# Altium project 升压模块12V转15V.PrjPCB
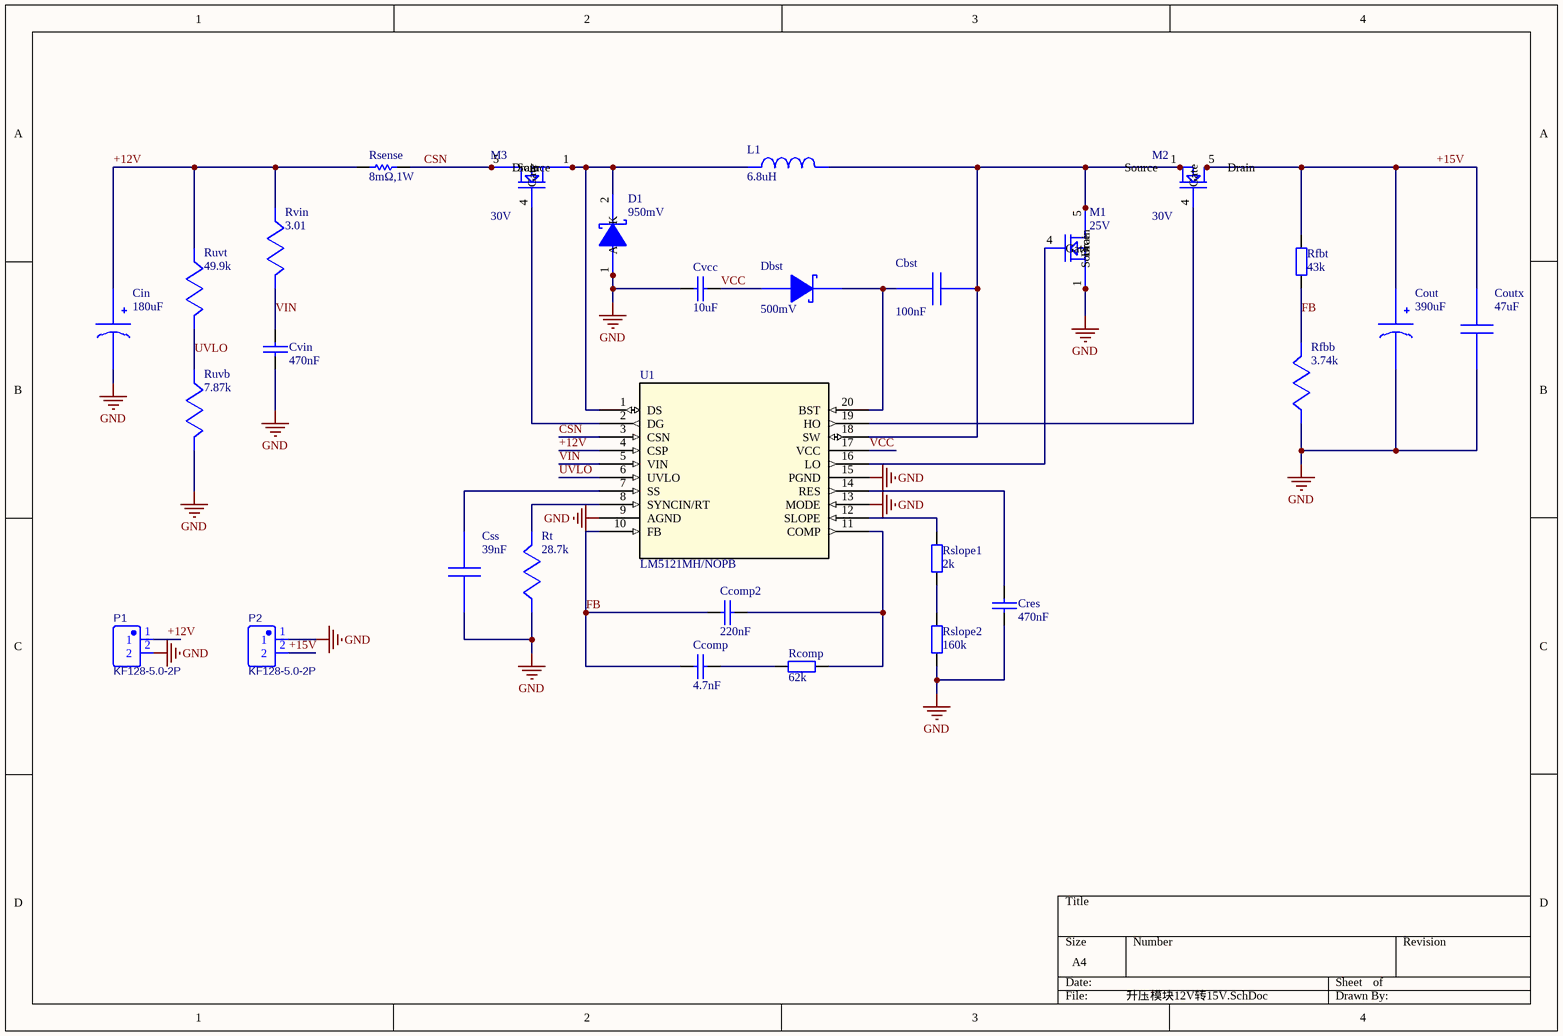
[diagram p0: 升压模块12V转15V.SchDoc]
1 sheet, 29 parts. Net scope: global (net labels, ports and power ports of the same name join across sheets).
Board file: 升压模块12V转15V.PcbDoc

## Sheet 升压模块12V转15V.SchDoc
size A4

### Parts
Cbst  value 100nF  [0805]  (hidden comment: C0805C104M5RACTU)
Ccomp  4.7nF  [0805C]
Ccomp2  220nF  [0805C]
Cin  value 180uF  [CAPSMT_62_E7]  (hidden comment: 20SVPF180M)
Cout  value 390uF  [CAPSMT_62_E12]  (hidden comment: 20SVPF390M)
Coutx  value 47uF  [1206]  (hidden comment: C3216X5R1E476M160AC)
Cres  470nF  [0805C]
Css  value 39nF  [0402]  (hidden comment: GRM155R71E393KA88D)
Cvcc  10uF  [0805C]
Cvin  470nF  [0805C]
D1  value 950mV  [DPAK]  (hidden comment: SBRD10200TR)
Dbst  value 500mV  [SMB]  (hidden comment: B220-13-F)
L1  value 6.8uH  [SER2915L]  (hidden comment: SER2915L-682KL)
M1  value 25V  [DQG0008A]  (hidden comment: CSD16327Q3)
M2  value 30V  [DQG0008A]  (hidden comment: CSD17575Q3)
M3  value 30V  [TRANS_Fairchild_]  (hidden comment: FDMC7660DC)
P1  KF128-5.0-2P  [CONN-TH_P5.00_KF128-5.0-2P]
P2  KF128-5.0-2P  [CONN-TH_P5.00_KF128-5.0-2P]
Rcomp  62k  [0805R]
Rfbb  value 3.74k  [0402]  (hidden comment: CRCW04023K74FKED)
Rfbt  43k  [0805R]
Rsense  8mΩ,1W  [R2512]
Rslope1  2k  [0805R]
Rslope2  160k  [0805R]
Rt  value 28.7k  [0201]  (hidden comment: RC0201FR-0728K7L)
Ruvb  value 7.87k  [0402]  (hidden comment: CRCW04027K87FKED)
Ruvt  value 49.9k  [0402]  (hidden comment: CRCW040249K9FKED)
Rvin  value 3.01  [0402]  (hidden comment: CRCW04023R01FKED)
U1  LM5121MH/NOPB  [PWP20_TEX]

### Nets
GND: Cin.2(-) Cout.2(-) Coutx.2 Cres.1 Css.2 Cvcc.1 Cvin.1 D1.1(A) D1.3(A) M1.1(Source) M1.2(Source) M1.3(Source) P1.2 P2.1 Rfbb.2 Rslope2.1 Rt.2 Ruvb.1 U1.9(AGND) U1.13(MODE) U1.15(PGND)
+12V: Cin.1(+) P1.1 Rsense.1 Ruvt.2 Rvin.2 U1.4(CSP)
+15V: Cout.1(+) Coutx.1 M2.5(Drain) M2.6(Drain) M2.7(Drain) M2.8(Drain) M2.9(Drain) P2.2 Rfbt.2
CSN: M3.5(Drain) M3.6(Drain) M3.7(Drain) M3.8(Drain) Rsense.2 U1.3(CSN)
FB: Ccomp.2 Ccomp2.2 Rfbb.1 Rfbt.1 U1.10(FB)
UVLO: Ruvb.2 Ruvt.1 U1.6(UVLO)
VCC: Cvcc.2 Dbst.2(A) U1.17(VCC)
VIN: Cvin.2 Rvin.1 U1.5(VIN)
NetCbst_1: Cbst.1 L1.2 M1.5(Drain) M1.6(Drain) M1.7(Drain) M1.8(Drain) M1.9(Drain) M2.1(Source) M2.2(Source) M2.3(Source) U1.18(SW)
NetCbst_2: Cbst.2 Dbst.1(K) U1.20(BST)
NetCcomp2_1: Ccomp2.1 Rcomp.1 U1.11(COMP)
NetCcomp_1: Ccomp.1 Rcomp.2
NetCres_2: Cres.2 U1.14(RES)
NetCss_1: Css.1 U1.7(SS)
NetD1_2: D1.2(K) L1.1 M3.1(Source) M3.2(Source) M3.3(Source) U1.1(DS)
NetM1_4: M1.4(Gate) U1.16(LO)
NetM2_4: M2.4(Gate) U1.19(HO)
NetM3_4: M3.4(Gate) U1.2(DG)
NetRslope1_1: Rslope1.1 Rslope2.2
NetRslope1_2: Rslope1.2 U1.12(SLOPE)
NetRt_1: Rt.1 U1.8(SYNCIN/RT)

### Library data of the parts
Cbst = Cbst: Manufacturer Name: Kemet; PackageReference: C0805C104M5RACTU; Manufacturer Part Number: C0805C104M5RACTU
Ccomp Ccomp2 Cres Cvcc Cvin = CAP: Capacitor
Cin = Cin: Manufacturer Name: Panasonic; PackageReference: 20SVPF180M; Manufacturer Part Number: 20SVPF180M
Cout = Cout: Manufacturer Name: Panasonic; PackageReference: 20SVPF390M; Manufacturer Part Number: 20SVPF390M
Coutx = Coutx: C3216X5R1E476M16; Manufacturer Name: TDK; PackageReference: C3216X5R1E476M160AC; Manufacturer Part Number: C3216X5R1E476M160AC
Css = Css: GRM155R71E393KA8; Manufacturer Name: MuRata; PackageReference: GRM155R71E393KA88D; Manufacturer Part Number: GRM155R71E393KA88D
D1 = D1: Manufacturer Name: SMC Diode Solutions; PackageReference: SBRD10200TR; Manufacturer Part Number: SBRD10200TR
Dbst = Dbst: Manufacturer Name: Diodes Inc.; PackageReference: B220-13-F; Manufacturer Part Number: B220-13-F
L1 = 电感-SER2915L: Manufacturer Name: Coilcraft; PackageReference: SER2915L-682KL; Manufacturer Part Number: SER2915L-682KL
M1 = M1: Manufacturer Name: Texas Instruments; PackageReference: CSD16327Q3; Manufacturer Part Number: CSD16327Q3
M2 = M2: Manufacturer Name: Texas Instruments; PackageReference: CSD17575Q3; Manufacturer Part Number: CSD17575Q3
M3 = M3: Manufacturer Name: Fairchild Semiconductor; PackageReference: FDMC7660DC; Manufacturer Part Number: FDMC7660DC
P1 P2 = KF128-2P: BOM_Manufacturer: Cixi Kefa Elec; Contributor: LCSC; BOM_Supplier: LCSC; BOM_Supplier Part: C474950; BOM_Manufacturer Part: KF128-5.0-2P; spicePre: U; spiceSymbolName: KF128-5.0-2P
Rcomp Rfbt Rslope1 Rslope2 = Res: Resistor
Rfbb = Rfbb: Manufacturer Name: Vishay-Dale; PackageReference: CRCW04023K74FKED; Manufacturer Part Number: CRCW04023K74FKED
Rsense = 采样电阻
Rt = Rt: Manufacturer Name: Yageo; PackageReference: RC0201FR-0728K7L; Manufacturer Part Number: RC0201FR-0728K7L
Ruvb = Ruvb: Manufacturer Name: Vishay-Dale; PackageReference: CRCW04027K87FKED; Manufacturer Part Number: CRCW04027K87FKED
Ruvt = Ruvt: Manufacturer Name: Vishay-Dale; PackageReference: CRCW040249K9FKED; Manufacturer Part Number: CRCW040249K9FKED
Rvin = Rvin: Manufacturer Name: Vishay-Dale; PackageReference: CRCW04023R01FKED; Manufacturer Part Number: CRCW04023R01FKED
U1 = LM5121MH/NOPB: Vendor: Texas Instruments; Built_By: EMA_Jessica; SourceLibrary: TI_2019-05-10; Manufacturer_Part_Number: LM5121MH/NOPB; Copyright: Copyright (C) 2018 Accelerated Designs. All rights reserved; RefDes: RefDes; Type: DEV